# Altium schematic sheet 通讯板原理图.SchDoc
size A3
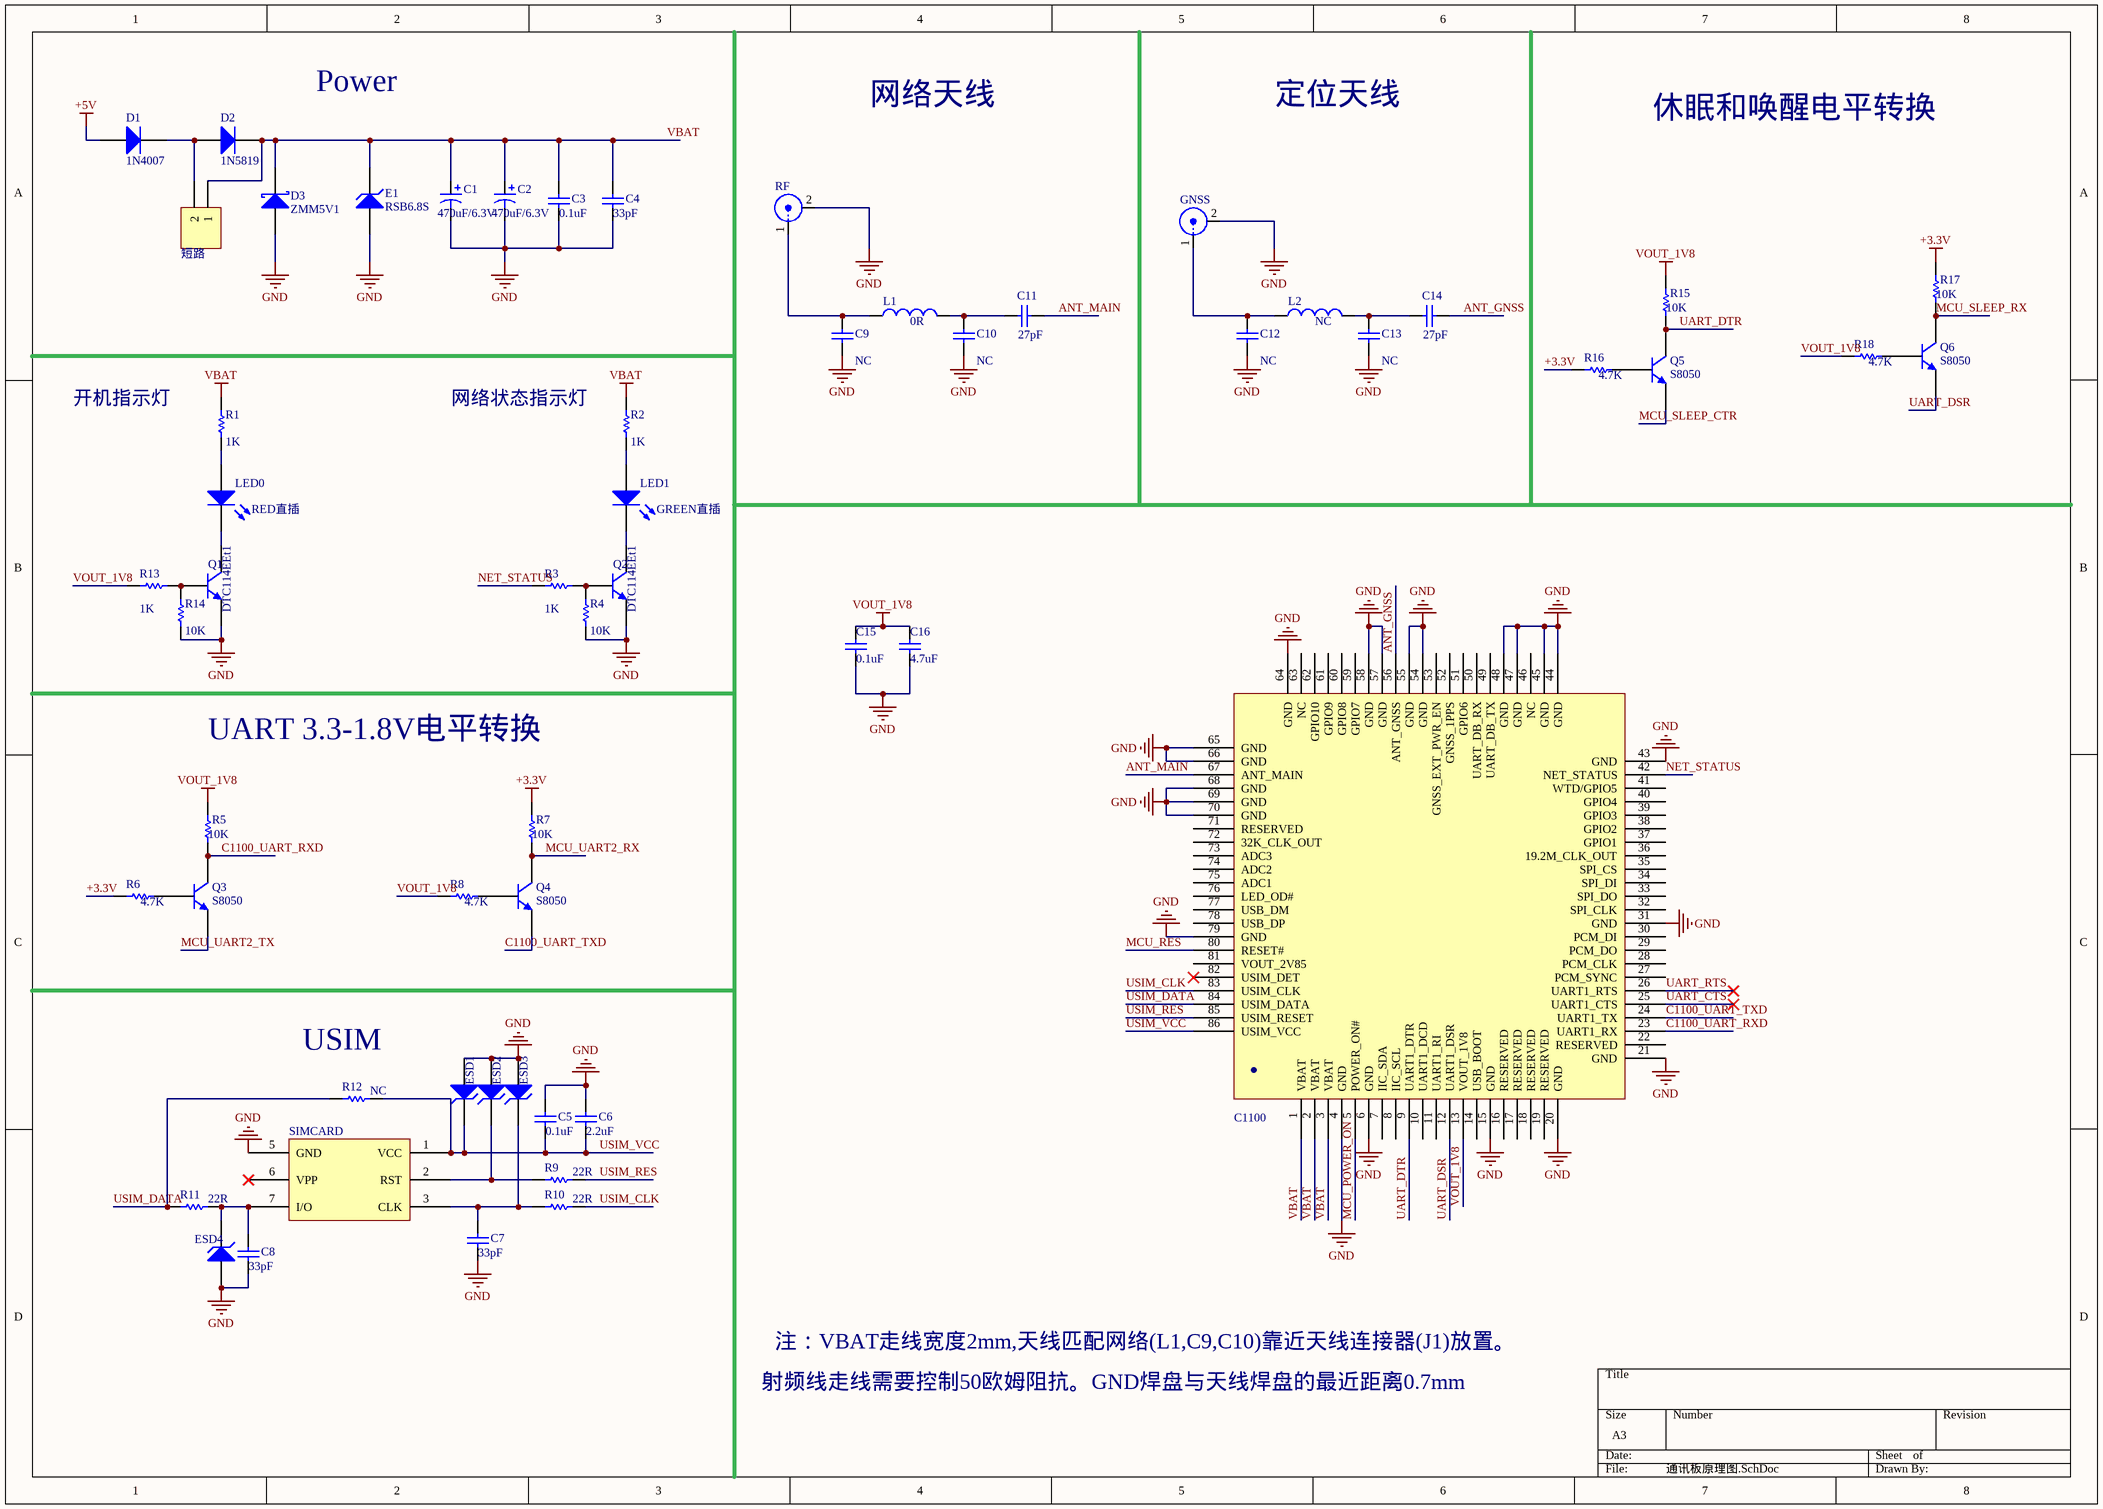
[diagram p0: 通讯板原理图.SchDoc]

## Parts
C1  value 470uF/6.3V  [钽电容(D)]  (hidden comment: 477L)
C2  value 470uF/6.3V  [钽电容(D)]  (hidden comment: 477L)
C3  value 0.1uF  [0805]  (hidden comment: 104)
C4  value 33pF  [0805]  (hidden comment: 33)
C5  value 0.1uF  [0805]  (hidden comment: 104)
C6  value 2.2uF  [0805]  (hidden comment: 225)
C7  value 33pF  [0805]  (hidden comment: 33)
C8  value 33pF  [0805]  (hidden comment: 33)
C9  NC  [0805]
C10  NC  [0805]
C11  value 27pF  [0805]  (hidden comment: 27)
C12  NC  [0805]
C13  NC  [0805]
C14  value 27pF  [0805]  (hidden comment: 27)
C15  value 0.1uF  [0805]  (hidden comment: 104)
C16  value 4.7uF  [0805]  (hidden comment: 475)
C1100  C1100  [C1100]  (value not drawn)
D1  1N4007  [M7]
D2  1N5819  [M7]
D3  ZMM5V1  [ZMM5V1]
E1  RSB6.8S  [0603]
ESD1  SZESD7361HT1G  [0603]  (value not drawn)
ESD2  SZESD7361HT1G  [0603]  (value not drawn)
ESD3  SZESD7361HT1G  [0603]  (value not drawn)
ESD4  SZESD7361HT1G  [0603]  (value not drawn)
GNSS  IPX  [IPX]  (value not drawn)
L1  0R  [0805]
L2  NC  [0805]
LED0  RED直插  [LED]
LED1  GREEN直插  [LED]
Q1  DTC114EEt1  [DTC114EEt1]
Q2  DTC114EEt1  [DTC114EEt1]
Q3  S8050  [NPN]
Q4  S8050  [NPN]
Q5  S8050  [NPN]
Q6  S8050  [NPN]
R1  1K  [0805]
R2  1K  [0805]
R3  1K  [0805]
R4  10K  [0805]
R5  10K  [0805]
R6  4.7K  [0805]
R7  10K  [0805]
R8  4.7K  [0805]
R9  22R  [0805]
R10  22R  [0805]
R11  22R  [0805]
R12  NC  [0805]
R13  1K  [0805]
R14  10K  [0805]
R15  10K  [0805]
R16  4.7K  [0805]
R17  10K  [0805]
R18  4.7K  [0805]
RF  SMA  [SMA-2]  (value not drawn)
SIMCARD  SIM-ACARD  [SIMCARD]  (value not drawn)
短路  Header 2  [HEDX2]  (value not drawn)

## Nets
+3.3V: R6.1 R7.2 R16.1 R17.2
+5V: D1.1(A)
GND: C1.2 C2.2 C3.2 C4.2 C5.2 C6.2 C7.1 C8.1 C9.1 C10.1 C12.1 C13.1 C15.1 C16.1 C1100.4(GND) C1100.6(GND) C1100.15(GND) C1100.20(GND) C1100.21(GND) C1100.31(GND) C1100.43(GND) C1100.44(GND) C1100.45(GND) C1100.47(GND) C1100.48(GND) C1100.54(GND) C1100.55(GND) C1100.57(GND) C1100.58(GND) C1100.64(GND) C1100.65(GND) C1100.66(GND) C1100.68(GND) C1100.69(GND) C1100.70(GND) C1100.79(GND) D3.1(A) E1.1(A) ESD1.1(A) ESD2.1(A) ESD3.1(A) ESD4.1(A) GNSS.2(Y) Q1.2(E) Q2.2(E) R4.1 R14.1 RF.2(Y) SIMCARD.5(GND)
VBAT: C1.1 C2.1 C3.1 C4.1 C1100.1(VBAT) C1100.2(VBAT) C1100.3(VBAT) D2.2(K) D3.2(K) E1.2(K) R1.2 R2.2 短路.1
VOUT_1V8: C15.2 C16.2 C1100.13(VOUT_1V8) R5.2 R8.1 R13.1 R15.2 R18.1
ANT_GNSS: C14.2 C1100.56(ANT_GNSS)
ANT_MAIN: C11.2 C1100.67(ANT_MAIN)
C1100_UART_RXD: C1100.23(UART1_RX) Q3.3(C) R5.1
C1100_UART_TXD: C1100.24(UART1_TX) Q4.2(E)
MCU_POWER_ON: C1100.5(POWER_ON#)
MCU_RES: C1100.80(RESET#)
MCU_SLEEP_CTR: Q5.2(E)
MCU_SLEEP_RX: Q6.3(C) R17.1
MCU_UART2_RX: Q4.3(C) R7.1
MCU_UART2_TX: Q3.2(E)
NET_STATUS: C1100.42(NET_STATUS) R3.1
UART_CTS: C1100.25(UART1_CTS)
UART_DSR: C1100.12(UART1_DSR) Q6.2(E)
UART_DTR: C1100.9(UART1_DTR) Q5.3(C) R15.1
UART_RTS: C1100.26(UART1_RTS)
USIM_CLK: C1100.83(USIM_CLK) R10.2
USIM_DATA: C1100.84(USIM_DATA) R11.1 R12.1
USIM_RES: C1100.85(USIM_RESET) R9.2
USIM_VCC: C5.1 C6.1 C1100.86(USIM_VCC) ESD1.2(K) R12.2 SIMCARD.1(VCC)
NetC7_2: C7.2 ESD3.2(K) R10.1 SIMCARD.3(CLK)
NetC8_2: C8.2 ESD4.2(K) R11.2 SIMCARD.7(I/O)
NetC9_2: C9.2 L1.1 RF.1(X)
NetC10_2: C10.2 C11.1 L1.2
NetC12_2: C12.2 GNSS.1(X) L2.1
NetC13_2: C13.2 C14.1 L2.2
NetD1_2: D1.2(K) D2.1(A) 短路.2
NetESD2_2: ESD2.2(K) R9.1 SIMCARD.2(RST)
NetLED0_1: LED0.1(A) R1.1
NetLED0_2: LED0.2(K) Q1.3(C)
NetLED1_1: LED1.1(A) R2.1
NetLED1_2: LED1.2(K) Q2.3(C)
NetQ1_1: Q1.1(B) R13.2 R14.2
NetQ2_1: Q2.1(B) R3.2 R4.2
NetQ3_1: Q3.1(B) R6.2
NetQ4_1: Q4.1(B) R8.2
NetQ5_1: Q5.1(B) R16.2
NetQ6_1: Q6.1(B) R18.2

Not connected (* = marked no-connect by the designer): C1100 7(IIC_SDA) 8(IIC_SCL) 10(UART1_DCD) 11(UART1_RI) 14(USB_BOOT) 16(RESERVED) 17(RESERVED) 18(RESERVED) 19(RESERVED) 22(RESERVED) 27(PCM_SYNC) 28(PCM_CLK) 29(PCM_DO) 30(PCM_DI) 32(SPI_CLK) 33(SPI_DO) 34(SPI_DI) 35(SPI_CS) 36(19.2M_CLK_OUT) 37(GPIO1) 38(GPIO2) 39(GPIO3) 40(GPIO4) 41(WTD/GPIO5) 46(NC) 49(UART_DB_TX) 50(UART_DB_RX) 51(GPIO6) 52(GNSS_1PPS) 53(GNSS_EXT_PWR_EN) 59(GPIO7) 60(GPIO8) 61(GPIO9) 62(GPIO10) 63(NC) 71(RESERVED) 72(32K_CLK_OUT) 73(ADC3) 74(ADC2) 75(ADC1) 76(LED_OD#) 77(USB_DM) 78(USB_DP) 81(VOUT_2V85) 82(USIM_DET)*; SIMCARD 6(VPP)*

## Notes on the sheet
- Power
- 网络天线
- 定位天线
- 休眠和唤醒电平转换
- 开机指示灯
- 网络状态指示灯
- UART 3.3-1.8V电平转换
- (near R12) USIM
- 射频线走线需要控制50欧姆阻抗。GND焊盘与天线焊盘的最近距离0.7mm
- 注：VBAT走线宽度2mm,天线匹配网络(L1,C9,C10)靠近天线连接器(J1)放置。
- (in symbol C1100) .

## Library data of the parts
C1 C2 = Cap Pol1: Polarized Capacitor (Radial); Published: 8-Jun-2000; LatestRevisionDate: 17-Jul-2002; LatestRevisionNote: Re-released for DXP Platform.; PackageReference: RB7.6-15; Publisher: Altium Limited; PackageDescription: Polarized Capacitor (Radial); 2 Leads
C3-C16 = Cap: Capacitor; Published: 8-Jun-2000; LatestRevisionDate: 17-Jul-2002; LatestRevisionNote: Re-released for DXP Platform.; PackageReference: RAD-0.3; Publisher: Altium Limited; PackageDescription: Radial Cap, Thru-Hole; 2 Leads; 0.3 in Pin Spacing
  C9 C10 C12 C13: Value: NC
D1 = Diode 1N4007: 1 Amp General Purpose Rectifier; Published: 8-Jun-2000; LatestRevisionDate: 17-Jul-2002; LatestRevisionNote: Re-released for DXP Platform.; DatasheetVersion: 1998; PackageVersion: Aug-1999; PackageReference: DO-41; Publisher: Altium Limited; PackageDescription: Diode, Axial; Body 5.2 x 2.7 mm (LxDia. max), Lead Dia. 0.86 mm (max); Code_JEDEC: DO-204-AL; ComponentLink1Description: Manufacturer Link; ComponentLink1URL: http://www.fairchildsemi.com/; ComponentLink2Description: Datasheet; ComponentLink2URL: http://www.fairchildsemi.com/ds/1N%2F1N4001.pdf
D2 = Diode 1N5402: 3 Amp General Purpose Rectifier; Published: 8-Jun-2000; LatestRevisionDate: 17-Jul-2002; LatestRevisionNote: Re-released for DXP Platform.; DatasheetVersion: 1998; PackageVersion: Aug-1999; PackageReference: DO-201AD; Publisher: Altium Limited; PackageDescription: Diode, Axial; Body 9.5 x 5.6 mm (LxDia. max), Lead Dia. 1.32 mm (max); ComponentLink1Description: Manufacturer Link; ComponentLink1URL: http://www.fairchildsemi.com/; ComponentLink2Description: Datasheet; ComponentLink2URL: http://www.fairchildsemi.com/ds/1N%2F1N5400.pdf
D3 = Diode 10TQ035: Schottky Rectifier; Note: Terminal 2 is the TAB and is electrically connected to the cathode; Published: 8-Jun-2000; LatestRevisionDate: 17-Jul-2002; LatestRevisionNote: Re-released for DXP Platform.; DatasheetVersion: PD-2.057B; PackageVersion: Feb-1998; PackageReference: TO-220AC; Publisher: Altium Limited; PackageDescription: TO, Thru-Hole, Vertical, Heatsink Mounted; 3 In-Line Leads (1 Absent); Pitch 2.54 mm; ComponentLink1Description: Manufacturer Link; ComponentLink1URL: http://www.irf.com/; ComponentLink2Description: Datasheet; ComponentLink2URL: http://www.irf.com/product-info/datasheets/data/10tq.pdf
E1 ESD1-ESD4 = D Zener: Zener Diode; Published: 8-Jun-2000; LatestRevisionDate: 17-Jul-2002; LatestRevisionNote: Re-released for DXP Platform.; PackageReference: DIODE-0.7; Publisher: Altium Limited; PackageDescription: Diode, Thru-Hole; 2 Leads; 0.7 in Pin Spacing
GNSS RF = SMB: SMB Straight Connector; LatestRevisionDate: 17-Jul-2002; LatestRevisionNote: Re-released for DXP Platform.; Publisher: Altium Limited
L1 L2 = Inductor: Code_IEC: 1005; Published: 8-Jun-2000; LatestRevisionDate: 29-May-2009; LatestRevisionNote: IPC-7351 Footprint Added.; PackageReference: 0402-A; Publisher: Altium Limited; PackageDescription: Chip Inductor; Code_JEITA: 0402
  L1: Value: 0R
  L2: Value: NC
LED0 LED1 = LED0: Typical INFRARED GaAs LED; Published: 8-Jun-2000; LatestRevisionDate: 08-Jul-2005; LatestRevisionNote: Mech Layer 1 removed.; PackageReference: LED-0; Publisher: Altium Limited; PackageDescription: LED; 2 Leads
Q1-Q6 = NPN: NPN Bipolar Transistor; Published: 8-Jun-2000; LatestRevisionDate: 17-Jul-2002; LatestRevisionNote: Re-released for DXP Platform.; PackageReference: TO-226-AA; Publisher: Altium Limited; PackageDescription: TO, Flat Index; 3 In-Line, Axial Leads; Body Dia. 4.8mm; Leads 0.55 x 0.51 mm (max); Code_JEDEC: TO-226-AA
R1-R18 = Res1: Resistor; Published: 8-Jun-2000; LatestRevisionDate: 17-Jul-2002; LatestRevisionNote: Re-released for DXP Platform.; PackageReference: AXIAL-0.3; Publisher: Altium Limited; PackageDescription: Axial Device, Thru-Hole; 2 Leads; 0.3 in Pin Spacing
  R1-R3 R13: Value: 1K
  R4 R5 R7 R14 R15 R17: Value: 10K
  R6 R8 R16 R18: Value: 4.7K
  R9-R11: Value: 22R
  R12: Value: NC
SIMCARD = SIMCARD
短路 = Header 2: Header, 2-Pin; LatestRevisionDate: 17-Jul-2002; LatestRevisionNote: Re-released for DXP Platform.; Publisher: Altium Limited